# Altium project 2024_TCU.PrjPcb (part 1 of 2)
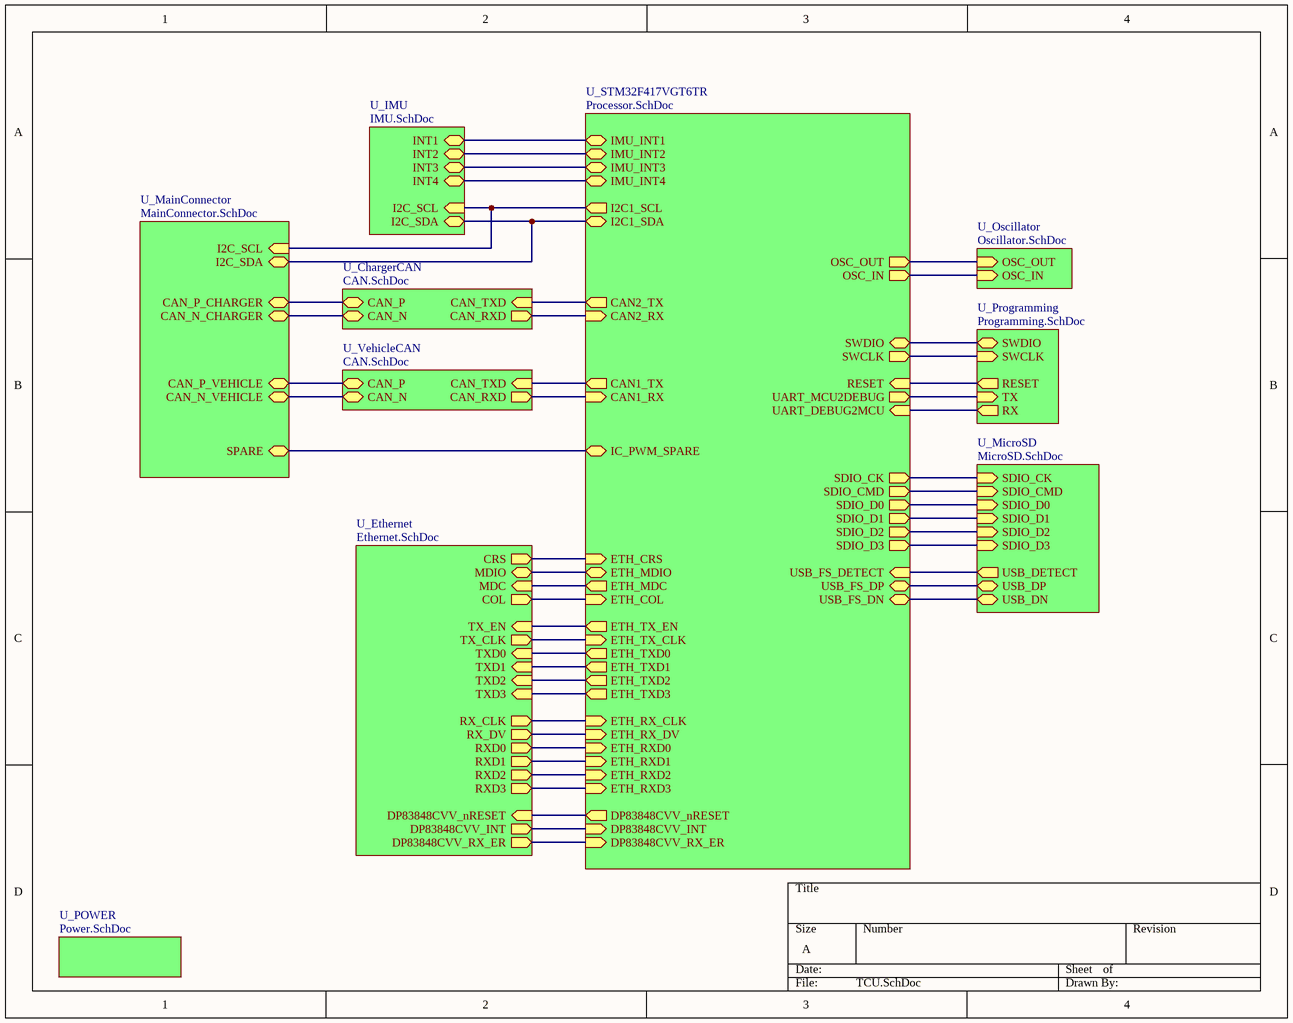
[diagram p0: TCU.SchDoc]
10 sheets, 116 parts. Net scope: hierarchical (ports join the sheet entries above them; power ports are global).
Board file: 2024_TCU.PcbDoc
Sheets:
  TCU.SchDoc
    U_MicroSD = MicroSD.SchDoc
    U_Programming = Programming.SchDoc
    U_VehicleCAN = CAN.SchDoc
    U_Oscillator = Oscillator.SchDoc
    U_STM32F417VGT6TR = Processor.SchDoc
    U_MainConnector = MainConnector.SchDoc
    U_ChargerCAN = CAN.SchDoc
    U_IMU = IMU.SchDoc
    U_Ethernet = Ethernet.SchDoc
    U_POWER = Power.SchDoc

## Sheet TCU.SchDoc
size A; SheetNumber: 1; SheetTotal: 10

### Sub-sheets
U_ChargerCAN = CAN.SchDoc: CAN_P (bidir), CAN_N (bidir), CAN_TXD (in), CAN_RXD (out)
U_Ethernet = Ethernet.SchDoc: DP83848CVV_INT (out), DP83848CVV_nRESET (in), CRS (out), RX_CLK (out), MDIO (bidir), COL (out), RX_DV (out), RXD2 (out), RXD3 (out), TX_EN (in), TXD0 (in), TXD1 (in), MDC (in), TXD2 (in), TX_CLK (out), RXD0 (out), RXD1 (out), TXD3 (in), DP83848CVV_RX_ER (out)
U_IMU = IMU.SchDoc: INT1 (bidir), INT2 (bidir), INT3 (bidir), INT4 (bidir), I2C_SDA (bidir), I2C_SCL (in)
U_MainConnector = MainConnector.SchDoc: CAN_P_VEHICLE (bidir), CAN_N_VEHICLE (bidir), CAN_P_CHARGER (bidir), CAN_N_CHARGER (bidir), I2C_SCL (in), I2C_SDA (bidir), SPARE (bidir)
U_MicroSD = MicroSD.SchDoc: SDIO_CK (in), SDIO_CMD (in), SDIO_D0 (in), SDIO_D1 (in), SDIO_D2 (in), SDIO_D3 (in), USB_DETECT (out), USB_DN (bidir), USB_DP (bidir)
U_Oscillator = Oscillator.SchDoc: OSC_IN (in), OSC_OUT (in)
U_POWER = Power.SchDoc: no entries
U_Programming = Programming.SchDoc: SWDIO (bidir), SWCLK (in), RESET (out), TX (in), RX (out)
U_STM32F417VGT6TR = Processor.SchDoc: OSC_OUT (out), OSC_IN (out), CAN1_TX (out), CAN1_RX (in), SWDIO (bidir), SWCLK (out), RESET (in), UART_MCU2DEBUG (out), UART_DEBUG2MCU (in), SDIO_CK (out), SDIO_CMD (out), SDIO_D0 (out), SDIO_D1 (out), SDIO_D2 (out), SDIO_D3 (out), USB_FS_DETECT (in), USB_FS_DP (bidir), USB_FS_DN (bidir), I2C1_SCL (out), I2C1_SDA (bidir), IMU_INT1 (bidir), IMU_INT2 (bidir), IMU_INT3 (bidir), IMU_INT4 (bidir), CAN2_RX (in), CAN2_TX (out), ETH_MDC (out), ETH_MDIO (bidir), DP83848CVV_INT (in), DP83848CVV_nRESET (out), ETH_COL (in), ETH_CRS (in), ETH_RXD0 (in), ETH_RXD1 (in), ETH_RXD2 (in), ETH_RXD3 (in), ETH_RX_CLK (in), ETH_RX_DV (in), ETH_TXD0 (out), ETH_TXD1 (out), ETH_TXD2 (out), ETH_TXD3 (out), ETH_TX_CLK (in), ETH_TX_EN (out), DP83848CVV_RX_ER (in), IC_PWM_SPARE (bidir)
U_VehicleCAN = CAN.SchDoc: CAN_P (bidir), CAN_N (bidir), CAN_TXD (in), CAN_RXD (out)

### Nets
CAN_CONN_H: sheet U_VehicleCAN/CAN_P, sheet U_MainConnector/CAN_P_VEHICLE
CAN_CONN_H: sheet U_MainConnector/CAN_P_CHARGER, sheet U_ChargerCAN/CAN_P  [a separate net that carries the same name]
CAN_CONN_L: sheet U_VehicleCAN/CAN_N, sheet U_MainConnector/CAN_N_VEHICLE
CAN_CONN_L: sheet U_MainConnector/CAN_N_CHARGER, sheet U_ChargerCAN/CAN_N  [a separate net that carries the same name]
MII_MDC: sheet U_STM32F417VGT6TR/ETH_MDC, sheet U_Ethernet/MDC
MII_MDIO: sheet U_STM32F417VGT6TR/ETH_MDIO, sheet U_Ethernet/MDIO
RESET: sheet U_Programming/RESET, sheet U_STM32F417VGT6TR/RESET
SD_CK: sheet U_MicroSD/SDIO_CK, sheet U_STM32F417VGT6TR/SDIO_CK
SD_CMD: sheet U_MicroSD/SDIO_CMD, sheet U_STM32F417VGT6TR/SDIO_CMD
SD_D0: sheet U_MicroSD/SDIO_D0, sheet U_STM32F417VGT6TR/SDIO_D0
SD_D1: sheet U_MicroSD/SDIO_D1, sheet U_STM32F417VGT6TR/SDIO_D1
SD_D2: sheet U_MicroSD/SDIO_D2, sheet U_STM32F417VGT6TR/SDIO_D2
SD_D3: sheet U_MicroSD/SDIO_D3, sheet U_STM32F417VGT6TR/SDIO_D3
SWCLK: sheet U_Programming/SWCLK, sheet U_STM32F417VGT6TR/SWCLK
SWDIO: sheet U_Programming/SWDIO, sheet U_STM32F417VGT6TR/SWDIO
UART_DGB2MCU: sheet U_Programming/RX, sheet U_STM32F417VGT6TR/UART_DEBUG2MCU
UART_MCU2DGB: sheet U_Programming/TX, sheet U_STM32F417VGT6TR/UART_MCU2DEBUG
USB_BOARD_N: sheet U_MicroSD/USB_DN, sheet U_STM32F417VGT6TR/USB_FS_DN
USB_BOARD_P: sheet U_MicroSD/USB_DP, sheet U_STM32F417VGT6TR/USB_FS_DP
NetC20_2: sheet U_Oscillator/OSC_IN, sheet U_STM32F417VGT6TR/OSC_IN
NetIC1_1: sheet U_STM32F417VGT6TR/IMU_INT2, sheet U_IMU/INT2
NetIC1_12: sheet U_STM32F417VGT6TR/IMU_INT3, sheet U_IMU/INT3
NetIC1_13: sheet U_STM32F417VGT6TR/IMU_INT4, sheet U_IMU/INT4
NetIC1_16: sheet U_STM32F417VGT6TR/IMU_INT1, sheet U_IMU/INT1
NetIC2_7: sheet U_STM32F417VGT6TR/DP83848CVV_INT, sheet U_Ethernet/DP83848CVV_INT
NetIC2_29: sheet U_STM32F417VGT6TR/DP83848CVV_nRESET, sheet U_Ethernet/DP83848CVV_nRESET
NetIC2_41: sheet U_STM32F417VGT6TR/DP83848CVV_RX_ER, sheet U_Ethernet/DP83848CVV_RX_ER
NetJ3_3: sheet U_STM32F417VGT6TR/I2C1_SCL, sheet U_MainConnector/I2C_SCL, sheet U_IMU/I2C_SCL
NetJ3_5: sheet U_STM32F417VGT6TR/IC_PWM_SPARE, sheet U_MainConnector/SPARE
NetJ3_8: sheet U_STM32F417VGT6TR/I2C1_SDA, sheet U_MainConnector/I2C_SDA, sheet U_IMU/I2C_SDA
NetR5_1: sheet U_Oscillator/OSC_OUT, sheet U_STM32F417VGT6TR/OSC_OUT
NetR14_1: sheet U_STM32F417VGT6TR/ETH_TXD0, sheet U_Ethernet/TXD0
NetR15_1: sheet U_STM32F417VGT6TR/ETH_RXD0, sheet U_Ethernet/RXD0
NetR16_1: sheet U_STM32F417VGT6TR/ETH_TXD1, sheet U_Ethernet/TXD1
NetR17_1: sheet U_STM32F417VGT6TR/ETH_RXD1, sheet U_Ethernet/RXD1
NetR18_1: sheet U_STM32F417VGT6TR/ETH_TXD2, sheet U_Ethernet/TXD2
NetR19_1: sheet U_STM32F417VGT6TR/ETH_RXD2, sheet U_Ethernet/RXD2
NetR20_1: sheet U_STM32F417VGT6TR/ETH_TXD3, sheet U_Ethernet/TXD3
NetR21_1: sheet U_STM32F417VGT6TR/ETH_RXD3, sheet U_Ethernet/RXD3
NetR22_1: sheet U_STM32F417VGT6TR/ETH_TX_CLK, sheet U_Ethernet/TX_CLK
NetR23_1: sheet U_STM32F417VGT6TR/ETH_TX_EN, sheet U_Ethernet/TX_EN
NetR26_1: sheet U_STM32F417VGT6TR/ETH_CRS, sheet U_Ethernet/CRS
NetR27_1: sheet U_STM32F417VGT6TR/ETH_RX_DV, sheet U_Ethernet/RX_DV
NetR28_1: sheet U_STM32F417VGT6TR/ETH_RX_CLK, sheet U_Ethernet/RX_CLK
NetR29_1: sheet U_STM32F417VGT6TR/ETH_COL, sheet U_Ethernet/COL
NetR48_2: sheet U_MicroSD/USB_DETECT, sheet U_STM32F417VGT6TR/USB_FS_DETECT
NetU2_81: sheet U_VehicleCAN/CAN_RXD, sheet U_STM32F417VGT6TR/CAN1_RX
NetU2_82: sheet U_VehicleCAN/CAN_TXD, sheet U_STM32F417VGT6TR/CAN1_TX
NetU2_91: sheet U_STM32F417VGT6TR/CAN2_RX, sheet U_ChargerCAN/CAN_RXD
NetU2_92: sheet U_STM32F417VGT6TR/CAN2_TX, sheet U_ChargerCAN/CAN_TXD

## Sheet MicroSD.SchDoc
size A; SheetNumber: 9; SheetTotal: 10
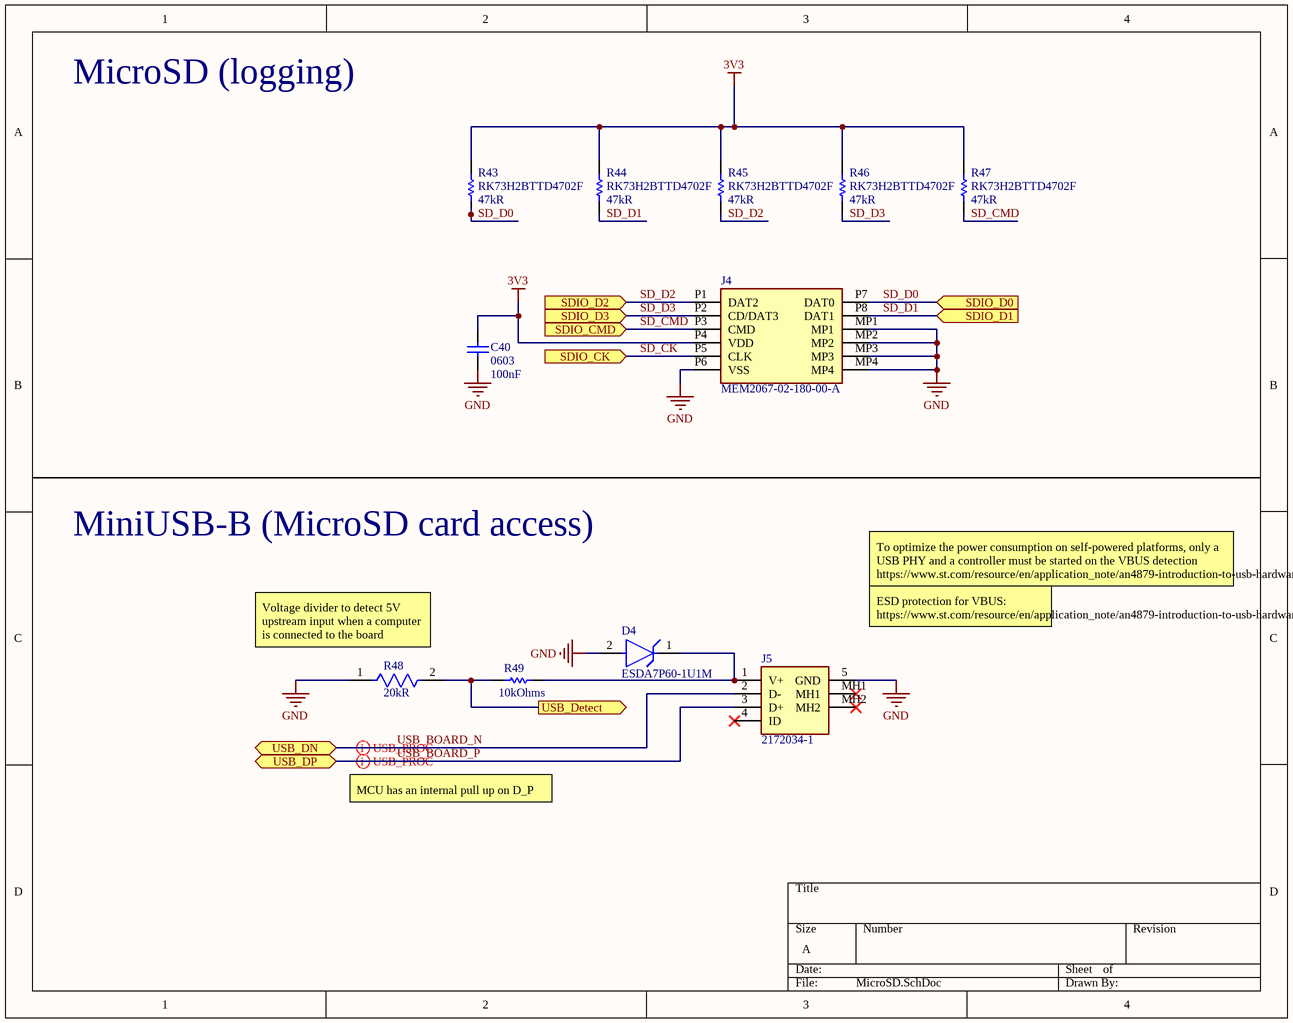
[diagram p1: MicroSD.SchDoc]

### Parts
C40  Case Code (Imperial): 0603  Capacitance: 100nF  [CAPC1608X87X35NL15T15]  (hidden comment: C0603X104K5RACTU)
D4  ESDA7P60-1U1M  [FP-1610-MFG]
J4  MEM2067-02-180-00-A  [MEM20670218000A]
J5  2172034-1  [21720341]
R43  RK73H2BTTD4702F  value 47kR  [RESC3216X70X40NL20T20]
R44  RK73H2BTTD4702F  value 47kR  [RESC3216X70X40NL20T20]
R45  RK73H2BTTD4702F  value 47kR  [RESC3216X70X40NL20T20]
R46  RK73H2BTTD4702F  value 47kR  [RESC3216X70X40NL20T20]
R47  RK73H2BTTD4702F  value 47kR  [RESC3216X70X40NL20T20]
R48  Resistance: 20kR  [FP-CRCW0805-e3-IPC_B]  (hidden comment: CRCW080520K0JNEB)
R49  Resistance: 10kOhms  [RESC1608X55X25ML10T15]  (hidden comment: RC0603JR-0710KL)

### Ports
SDIO_CK (in, see TCU[4B], Processor[2D]), SDIO_CMD (in, see TCU[4B], Processor[3B]), SDIO_D0 (in, see TCU[4B], Processor[2C]), SDIO_D1 (in, see TCU[4C], Processor[2C]), SDIO_D2 (in, see TCU[4C], Processor[2C]), SDIO_D3 (in, see TCU[4C], Processor[2D]), USB_Detect (out, see TCU[4C]), USB_DN (bidir, see TCU[4C]), USB_DP (bidir, see TCU[4C])

### Nets
3V3: C40.1 J4.P4(VDD) R43.2 R44.2 R45.2 R46.2 R47.2  [project net AVDD33]
GND: C40.2 D4.2(A) J4.MP1 J4.MP2 J4.MP3 J4.MP4 J4.P6(VSS) J5.5(GND) R48.1
SD_CK: J4.P5(CLK) ; port SDIO_CK
SD_CMD: J4.P3(CMD) R47.1 ; port SDIO_CMD
SD_D0: J4.P7(DAT0) R43.1 ; port SDIO_D0
SD_D1: J4.P8(DAT1) R44.1 ; port SDIO_D1
SD_D2: J4.P1(DAT2) R45.1 ; port SDIO_D2
SD_D3: J4.P2(CD/DAT3) R46.1 ; port SDIO_D3
USB_BOARD_N: J5.2(D-) ; port USB_DN
USB_BOARD_P: J5.3(D+) ; port USB_DP
NetD4_1: D4.1(C) J5.1(V+) R49.2
NetR48_2: R48.2 R49.1 ; port USB_Detect

Not connected (* = marked no-connect by the designer): J5 4(ID)* MH1* MH2*

### Layout directives
differential pair: USB_BOARD_N, USB_BOARD_P

### Notes on the sheet
- MicroSD (logging)
- MiniUSB-B (MicroSD card access)
- (near R48) Voltage divider to detect 5V upstream input when a computer is connected to the board
- ESD protection for VBUS:
  https://www.st.com/resource/en/application_note/an4879-introduction-to-usb-hardware-and-pcb-guidelines-using-stm32-mcus-stmicroelectronics.pdf
- To optimize the power consumption on self-powered platforms, only a USB PHY and a controller must be started on the VBUS detection
  https://www.st.com/resource/en/application_note/an4879-introduction-to-usb-hardware-and-pcb-guidelines-using-stm32-mcus-stmicroelectronics.pdf
- MCU has an internal pull up on D_P

### Library data of the parts
C40 = CMP-2006-03300-1: Manufacturer: Kemet; Dielectric Material: Ceramic; Tolerance: 10%; Voltage Rating: 50V; Dielectric: X7R; Dissipation Factor: 2.5%; Part Number: C0603X104K5RACTU; Supplier 1: Digi-Key; Supplier Part Number 1: 399-7969-1-ND; Manufacturer Part Number: C0603X104K5RACTU; Stock 1: 2206541; Pricing 1: 1 = 0.21000, 10 = 0.14500, 100 = 0.07340, 500 = 0.05024, 1000 = 0.04444 (USD); RoHS: Yes; Mount: Surface Mount; Case/Package: 0603; Number of Pins: 2; Case Code (Metric): 1608; Min Operating Temperature: -55°C; Max Operating Temperature: 125°C; Packaging: Tape and Reel; Package Quantity: 1; Voltage Rating (DC): 50V; Termination: SMD/SMT; Voltage: 50V; Features: Soft Termination; Length: 1.6mm; Height: 0.8mm; Width: 0.8mm; Depth: 0.8mm; Thickness: 0.034inch; Radiation Hardening: No; REACH SVHC: No SVHC; ComponentLink1URL: https://datasheet.ciiva.com/7823/1776088-7823908.pdf?src-supplier=Element14; ComponentLink1Description: https://datasheet.ciiva.com/7823/1776088-7823908.pdf?src-supplier=Element14; ComponentLink2URL: https://datasheet.ciiva.com/26948/getdatasheetpartid-385607-26948458.pdf?src-supplier=Verical; ComponentLink2Description: https://datasheet.ciiva.com/26948/getdatasheetpartid-385607-26948458.pdf?src-supplier=Verical; ComponentLink3URL: https://datasheet.ciiva.com/7823/1776088-7823909.pdf?src-supplier=Element14; ComponentLink3Description: https://datasheet.ciiva.com/7823/1776088-7823909.pdf?src-supplier=Element14; ComponentLink4URL: https://datasheet.ciiva.com/6279/kem-c1013-x7r-ft-cap-smd-6279993.pdf?src-supplier=Digi-Key; ComponentLink4Description: https://datasheet.ciiva.com/6279/kem-c1013-x7r-ft-cap-smd-6279993.pdf?src-supplier=Digi-Key; ComponentLink5URL: https://datasheet.ciiva.com/28533/1918693-28533212.pdf?src-supplier=Element14; ComponentLink5Description: https://datasheet.ciiva.com/28533/1918693-28533212.pdf?src-supplier=Element14; ComponentLink6URL: https://datasheet.ciiva.com/6279/kem-c1013-x7r-ft-cap-smd-6279999.pdf?src-supplier=Digi-Key; ComponentLink6Description: https://datasheet.ciiva.com/6279/kem-c1013-x7r-ft-cap-smd-6279999.pdf?src-supplier=Digi-Key; ComponentLink7URL: https://datasheet.ciiva.com/6279/kem-c1013-x7r-ft-cap-smd-6279990.pdf?src-supplier=Digi-Key; ComponentLink7Description: https://datasheet.ciiva.com/6279/kem-c1013-x7r-ft-cap-smd-6279990.pdf?src-supplier=Digi-Key; ComponentLink8URL: https://datasheet.ciiva.com/14597/70096394-14597743.pdf?src-supplier=Allied+Electronics; ComponentLink8Description: https://datasheet.ciiva.com/14597/70096394-14597743.pdf?src-supplier=Allied+Electronics
D4 = CMP-12225-000013-1: TVS DIODE 5V 11.6V 1610; Manufacturer: STMicroelectronics; Number Of Channels: 1; Standoff Height: 0mm; Breakdown Voltage: 6.4V; Direction: Unidirectional; Clamping Voltage: 10.2V; Peak Pulse Power: 700W; Peak Pulse Current: 60A; Max Junction Temp: +150°C; ComponentLink2Description: Datasheet; Temperature Range Low: -55°C; Package: 1610; Lead Free: Yes; Temperature Range High: +150°C; Temperature: -55°C to +150°C; Device Class L2: TVS Diodes; Category: Diode; Device Class L1: Circuit Protection; Manufacturer Part Number: ESDA7P60-1U1M; Digikey Description: TVS DIODE 5V 11.6V 1610; ComponentLink2URL: http://www.st.com/content/ccc/resource/technical/document/datasheet/44/e9/26/44/42/ee/4f/e5/DM00139972.pdf/files/DM00139972.pdf/jcr:content/translations/en.DM00139972.pdf; Reverse Standoff Voltage: 5V; RoHS: TRUE; Octopart: https://octopart.com/esda7p60-1u1m-stmicroelectronics-52112702; Height: 0.65mm; Device Class L3: unset; Automotive: No
J4 = MEM2067-02-180-00-A: Connector; Manufacturer_Name: GCT (GLOBAL CONNECTOR TECHNOLOGY); Datasheet Link: https://gct.co/files/drawings/mem2067.pdf; Height: 1.95mm; Manufacturer_Part_Number: MEM2067-02-180-00-A; Mouser Part Number: 640-MEM20670218000A; Mouser Price/Stock: https://www.mouser.co.uk/ProductDetail/GCT/MEM2067-02-180-00-A?qs=KUoIvG%2F9IlYTw%2Fcc1GlNJA%3D%3D; Supplier 1: Future Electronics; Supplier Part Number 1: 7054324
J5 = 2172034-1: Connector; Manufacturer_Name: TE Connectivity; Datasheet Link: https://www.te.com/commerce/DocumentDelivery/DDEController?Action=srchrtrv&DocNm=2172034&DocType=Customer+Drawing&DocLang=English; Height: 3.9mm; Manufacturer_Part_Number: 2172034-1; Mouser Part Number: 571-2172034-1; Mouser Price/Stock: https://www.mouser.co.uk/ProductDetail/TE-Connectivity/2172034-1?qs=Ev%252BS503VEAHBC%252BPBdsvCGg%3D%3D; Arrow Part Number: 2172034-1; Arrow Price/Stock: https://www.arrow.com/en/products/2172034-1/te-connectivity?region=nac; Supplier 1: Avnet; Supplier Part Number 1: 68AH8515
R43-R47 = CMP-2003-01472-1: Manufacturer: KOA Speer; Part Number: RK73H2BTTD4702F
R48 = CMP-02407-010660-1: RES Thick Film, 20kΩ, 5%, 0.125W, 200ppm/°C, 0805; Voltage Rating: 150V; Max Power Dissipation: 125mW; Case/Package: 0805; Number of Terminations: 2; Features: Automotive AEC-Q200; Tolerance: 5%; Height: 0.02inch; Case Code (Metric): 2012; Temperature Coefficient: 200ppm/°C; Max Operating Temperature: 155°C; Min Operating Temperature: -55°C; Length: 0.079inch; Weight: 0.000194oz; Case Code (Imperial): 0805; Composition: Thick Film; Width: 1.25mm; Lead Free: Lead Free; Power Rating: 125mW; Packaging: Tape and Reel; Termination: SMD/SMT; Package Quantity: 10000
R49 = CMP-2000-05022-1: Resistor, 10 KOhm, +/- 5%, 100 mW, -55 to 155 degC, 0603 (1608 Metric), RoHS, Tape and Reel; Manufacturer: Yageo; Voltage Rating: 50V; Temperature Coefficient: 100PPM/C; Power Rating: 100mW; Package Reference: 603; Series: RC; Case Code - mm: 1608; Packaging: Reel; Datasheet URL: http://www.farnell.com/datasheets/443971.pdf; Datasheet Version: Rev. 4, 04/2009; Operating Temperature Range: -55Cto+155C; Product: ThickFilmResistorsGeneralPurpose; Package Description: 2-Pin Surface Mount Device, Body 1.6 x 0.8 mm; Manufacturer URL: http://www.yageo.com/; Case Code - in: 0603; Tolerance: 5%; Termination Style: SMD/SMT

## Sheet Programming.SchDoc
size A4; DocumentNumber: 3; SheetNumber: 3; SheetTotal: 10
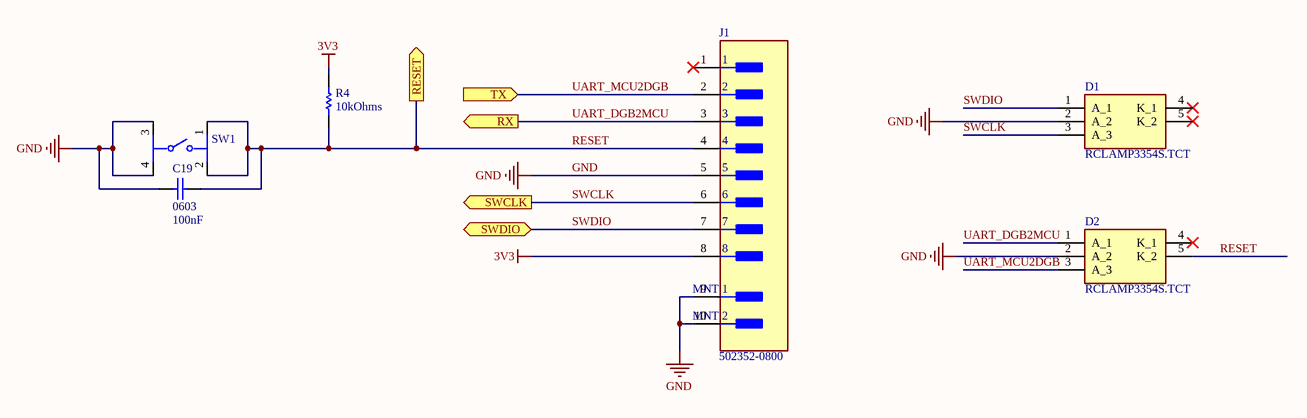
[diagram p2: Programming.SchDoc]

### Parts
C19  Case Code (Imperial): 0603  Capacitance: 100nF  [CAPC1608X87X35NL15T15]  (hidden comment: C0603X104K5RACTU)
D1  RCLAMP3354S.TCT  [SOT95P280X145-5N]
D2  RCLAMP3354S.TCT  [SOT95P280X145-5N]
J1  502352-0800  [FP-502352-0800-MFG]
R4  Resistance: 10kOhms  [RESC1608X55X25ML10T15]  (hidden comment: RC0603JR-0710KL)
SW1  PTS645SM43SMTR92LFS  [FP-PTS645SM43SMTR92LFS-MFG]  (value not drawn)

### Ports
RESET (out, see TCU[4B], Processor[3B]), RX (out, see TCU[4B]), SWCLK (out, see TCU[4B], Processor[2B]), SWDIO (bidir, see TCU[4B], Processor[2B]), TX (in, see TCU[4B])

### Nets
3V3: J1.8 R4.2  [project net AVDD33]
GND: C19.2 D1.2(A_2) D2.2(A_2) J1.5 J1.9(MNT_1) J1.10(MNT_2) SW1.3 SW1.4
RESET: C19.1 D2.5(K_2) J1.4 R4.1 SW1.1 SW1.2 ; port RESET
SWCLK: D1.3(A_3) J1.6 ; port SWCLK
SWDIO: D1.1(A_1) J1.7 ; port SWDIO
UART_DGB2MCU: D2.1(A_1) J1.3 ; port RX
UART_MCU2DGB: D2.3(A_3) J1.2 ; port TX

Not connected (* = marked no-connect by the designer): D1 4(K_1)* 5(K_2)*; D2 4(K_1)*; J1 1*

### Library data of the parts
C19 = CMP-2006-03300-1: as C40 on sheet MicroSD; Part Number: C0603X104K5RACTU; Supplier 1: Digi-Key; Supplier Part Number 1: 399-7969-1-ND; Manufacturer Part Number: C0603X104K5RACTU; Stock 1: 2206541; Pricing 1: 1 = 0.21000, 10 = 0.14500, 100 = 0.07340, 500 = 0.05024, 1000 = 0.04444 (USD); RoHS: Yes; Mount: Surface Mount; Case/Package: 0603; Number of Pins: 2; Case Code (Metric): 1608; Min Operating Temperature: -55°C; Max Operating Temperature: 125°C; Packaging: Tape and Reel; Package Quantity: 1; Voltage Rating (DC): 50V; Termination: SMD/SMT; Voltage: 50V; Features: Soft Termination; Length: 1.6mm; Height: 0.8mm; Width: 0.8mm; Depth: 0.8mm; Thickness: 0.034inch; Radiation Hardening: No; REACH SVHC: No SVHC; ComponentLink1URL: https://datasheet.ciiva.com/7823/1776088-7823908.pdf?src-supplier=Element14; ComponentLink1Description: https://datasheet.ciiva.com/7823/1776088-7823908.pdf?src-supplier=Element14; ComponentLink2URL: https://datasheet.ciiva.com/26948/getdatasheetpartid-385607-26948458.pdf?src-supplier=Verical; ComponentLink2Description: https://datasheet.ciiva.com/26948/getdatasheetpartid-385607-26948458.pdf?src-supplier=Verical; ComponentLink3URL: https://datasheet.ciiva.com/7823/1776088-7823909.pdf?src-supplier=Element14; ComponentLink3Description: https://datasheet.ciiva.com/7823/1776088-7823909.pdf?src-supplier=Element14; ComponentLink4URL: https://datasheet.ciiva.com/6279/kem-c1013-x7r-ft-cap-smd-6279993.pdf?src-supplier=Digi-Key; ComponentLink4Description: https://datasheet.ciiva.com/6279/kem-c1013-x7r-ft-cap-smd-6279993.pdf?src-supplier=Digi-Key; ComponentLink5URL: https://datasheet.ciiva.com/28533/1918693-28533212.pdf?src-supplier=Element14; ComponentLink5Description: https://datasheet.ciiva.com/28533/1918693-28533212.pdf?src-supplier=Element14; ComponentLink6URL: https://datasheet.ciiva.com/6279/kem-c1013-x7r-ft-cap-smd-6279999.pdf?src-supplier=Digi-Key; ComponentLink6Description: https://datasheet.ciiva.com/6279/kem-c1013-x7r-ft-cap-smd-6279999.pdf?src-supplier=Digi-Key; ComponentLink7URL: https://datasheet.ciiva.com/6279/kem-c1013-x7r-ft-cap-smd-6279990.pdf?src-supplier=Digi-Key; ComponentLink7Description: https://datasheet.ciiva.com/6279/kem-c1013-x7r-ft-cap-smd-6279990.pdf?src-supplier=Digi-Key; ComponentLink8URL: https://datasheet.ciiva.com/14597/70096394-14597743.pdf?src-supplier=Allied+Electronics; ComponentLink8Description: https://datasheet.ciiva.com/14597/70096394-14597743.pdf?src-supplier=Allied+Electronics
D1 D2 = RCLAMP3354S.TCT: TVS Diode (Bi-directional); Manufacturer_Name: SEMTECH; Datasheet Link: https://semtech.my.salesforce.com/sfc/p/#E0000000JelG/a/44000000MCrm/q3IJaquvh9BkANCL4E8HYT8vxS.k3jwPHRhsWr6XNsI; Height: 1.45mm; Manufacturer_Part_Number: RCLAMP3354S.TCT; Mouser Part Number: 947-RCLAMP3354S.TCT; Mouser Price/Stock: https://www.mouser.co.uk/ProductDetail/Semtech/RCLAMP3354S.TCT?qs=rBWM4%252BvDhIcjyMg1J9MbMw%3D%3D; Arrow Part Number: RCLAMP3354S.TCT; Arrow Price/Stock: https://www.arrow.com/en/products/rclamp3354s.tct/semtech?region=europe
  D1: Supplier 1: Arrow Electronics; Supplier Part Number 1: RCLAMP3354S.TCT
J1 = CMP-04776-000280-1: CONN HEADER SMD R/A 8POS 2MM; Max Current Rating: 3A; Primary Type: Rectangular; Number of Contacts: 8; Gender: Male; Connector Type: Male Pin; Glow Wire Compliant: Non-compliant; Voltage Rating: 125V; Orientation: Right Angle; Contact Plating: Tin; Series: DuraClik™ 502352; Color: Natural; Mount: Surface Mount; Contact Gender: Male; Length: 20mm; Radiation Hardening: No; Max Operating Temperature: 105°C; Package Quantity: 2800; Housing Material: Polyamide; Depth: 9.4mm; Current Rating: 3A; Pitch: 2mm; Housing Color: Natural; Contact Type: Male Pin; Number of Circuits: 8; Contact Material: Copper Alloy; Fastening Type: Latch; Number of Positions: 8; Packaging: Tape and Reel; Termination: Solder; Number of Rows: 1; Min Operating Temperature: -40°C
R4 = CMP-2000-05022-1: as R49 on sheet MicroSD; Package Reference: 603; Series: RC; Case Code - mm: 1608; Packaging: Reel; Datasheet URL: http://www.farnell.com/datasheets/443971.pdf; Datasheet Version: Rev. 4, 04/2009; Operating Temperature Range: -55Cto+155C; Product: ThickFilmResistorsGeneralPurpose; Package Description: 2-Pin Surface Mount Device, Body 1.6 x 0.8 mm; Manufacturer URL: http://www.yageo.com/; Case Code - in: 0603; Tolerance: 5%; Termination Style: SMD/SMT
SW1 = CMP-2000-05160-2: SWITCH TACTILE SPST-NO 0.05A 12V; Contact Resistance: 100mR; Throw Configuration: SPST; Illumination Type: Non-Illuminated; Mechanical Life: 100000Cycles; Current Rating: 50mA; Switch Function: Off-Mom; Actuator Length: 0.85mm; Actuator Material: Nylon; Actuator Type: Standard; Operating Force: 160gf; Min Operating Temperature: -20°C; REACH SVHC: No SVHC; Termination: Gull Wing; Case/Package: SMD/SMT; Packaging: Tape and Reel; Mount: Surface Mount; Voltage Rating (DC): 12V; Orientation: Straight; Lead Free: Lead Free; Contact Material: Silver; Color: Black; Max Current Rating: 50mA; Contact Plating: Silver; Depth: 9mm; Package Quantity: 1; Max Voltage Rating (DC): 12V; Length: 6mm; Max Operating Temperature: 60°C

## Sheet CAN.SchDoc
size A; SheetNumber: 6; SheetTotal: 10
Used 2 times, as channels U_VehicleCAN, U_ChargerCAN. Parts and nets are listed once, with the designators drawn on the sheet.
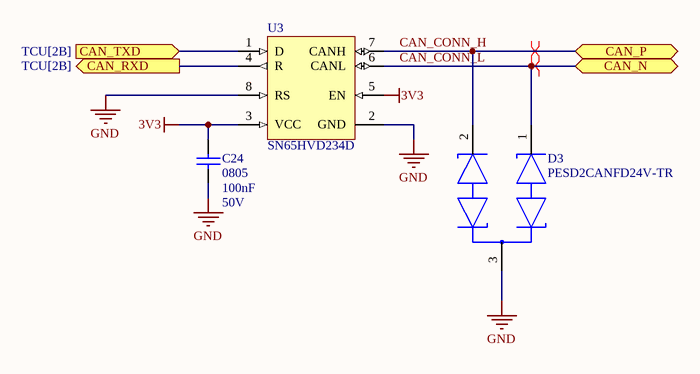
[diagram p3: CAN.SchDoc]

### Parts
C24  Case Code (Imperial): 0805  Capacitance: 100nF  Voltage Rating: 50V  [CAPC2013X88X50NL20T25]  (hidden comment: C0805C104K5RACTU)
D3  PESD2CANFD24V-TR  [FP-SOT23-IPC_A]
U3  SN65HVD234D  [D0008A_M]

### Ports
CAN_N (bidir, see TCU[2B]), CAN_P (bidir, see TCU[2B]), CAN_RXD (out, see TCU[2B]), CAN_TXD (in, see TCU[2B])

### Nets
3V3: C24.1 U3.3(VCC) U3.5(EN)
GND: C24.2 D3.3(CC) U3.2(GND) U3.8(RS)
CAN_CONN_H: D3.2(K2) U3.7(CANH) ; port CAN_P
CAN_CONN_L: D3.1(K1) U3.6(CANL) ; port CAN_N
CAN_RXD: U3.4(R) ; port CAN_RXD
CAN_TXD: U3.1(D) ; port CAN_TXD

### Channels
U_VehicleCAN: designators end in A; ports CAN_N=CAN_CONN_L CAN_P=CAN_CONN_H CAN_RXD=NetU2_81 CAN_TXD=NetU2_82
U_ChargerCAN: designators end in B; ports CAN_N=CAN_CONN_L CAN_P=CAN_CONN_H CAN_RXD=NetU2_91 CAN_TXD=NetU2_92

### Layout directives
differential pair: CAN_CONN_H, CAN_CONN_L

### Library data of the parts
C24 = CMP-2007-00279-1: Manufacturer: Kemet; Dielectric Material: Ceramic; Tolerance: 10%; Dielectric: X7R; Voltage: 500V; Part Number: C0805C104K5RACTU; Supplier 1: Digi-Key; Supplier Part Number 1: 399-1170-1-ND; Manufacturer Part Number: C0805C104K5RACTU; Stock 1: 1913908; Pricing 1: 1 = 0.23000, 10 = 0.16600, 100 = 0.07800, 500 = 0.05472, 1000 = 0.04530 (USD); RoHS: Yes; Mount: Surface Mount; Case/Package: 0805; Number of Pins: 2; Case Code (Metric): 2012; Contact Plating: Tin; Min Operating Temperature: -55°C; Max Operating Temperature: 125°C; Packaging: Tape and Reel; Voltage Rating (DC): 50V; Package Quantity: 1; Termination: SMD/SMT; Length: 2mm; Height: 0.9mm; Depth: 1.25mm; Width: 1.2mm; Thickness: 0.035inch; Lead Pitch: 0.75mm; Radiation Hardening: No; REACH SVHC: No SVHC; ComponentLink1URL: https://datasheet.ciiva.com/14589/70095383-14589048.pdf?src-supplier=Allied+Electronics; ComponentLink1Description: https://datasheet.ciiva.com/14589/70095383-14589048.pdf?src-supplier=Allied+Electronics; ComponentLink2URL: https://datasheet.ciiva.com/28682/1851736-28682232.pdf?src-supplier=Element14; ComponentLink2Description: https://datasheet.ciiva.com/28682/1851736-28682232.pdf?src-supplier=Element14; ComponentLink3URL: https://datasheet.ciiva.com/32431/slceramic-chip-condensers-e-32431755.pdf?src-supplier=Distrelec; ComponentLink3Description: https://datasheet.ciiva.com/32431/slceramic-chip-condensers-e-32431755.pdf?src-supplier=Distrelec; ComponentLink4URL: https://datasheet.ciiva.com/18410/70095383-18410815.pdf?src-supplier=Allied+Electronics; ComponentLink4Description: https://datasheet.ciiva.com/18410/70095383-18410815.pdf?src-supplier=Allied+Electronics
D3 = CMP-14436-000014-1: TVS DIODE 24VWM 42VC TO236AB
U3 = CMP-0315-00083-2: 3.3V CAN Transceiver with Sleep Mode, 6 mA, -40 to 125 degC, 8-pin SOIC (D), Green (RoHS & no Sb/Br); Manufacturer: Texas Instruments; Rating: Catalog; Receivers Per Package: 1; Bus Fault Voltage(V): +/-30; Transient Pulse Protection(V): -100 to 100; ICC(Max)(mA): 6; Supply Voltage(s)(V): 3.3; DatasheetVersion: SLLS557F; PackageVersion: revM, Jun-2011; Eco-Plan: Green (RoHS & no Sb/Br); PackageReference: D0008A; Drivers Per Package: 1; SubFamily: CAN; Code_JEDEC: MS-012AA; Isolated: No; ComponentLink1URL: http://www.ti.com/general/docs/lit/getliterature.tsp?genericPartNumber=SN65HVD234&fileType=pdf; Mounting Technology: Surface Mount; PackageDescription: 8-Pin Plastic Small Outline Integrated Circuit, 4.9 x 3.9 mm, Pitch 1.27 mm Pitch; PartNumber: SN65HVD234D; Footprint: PCA82C250, excludes pin5; Low Power Mode: Sleep; ComponentLink1Description: Datasheet

## Sheet Oscillator.SchDoc
size A; SheetNumber: 4; SheetTotal: 10
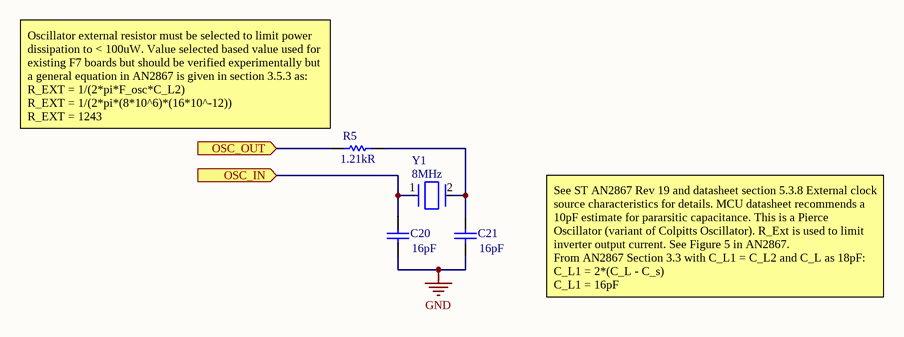
[diagram p4: Oscillator.SchDoc]

### Parts
C20  Capacitance: 16pF  [CAPC1608X90X35ML15T15]  (hidden comment: 06035A160JAT2A)
C21  Capacitance: 16pF  [CAPC1608X90X35ML15T15]  (hidden comment: 06035A160JAT2A)
R5  Resistance: 1.21kR  [RESC1005X40X25NL10T10]  (hidden comment: CR0402-FX-1211GLF)
Y1  Frequency: 8MHz  [FP-ABM3-MFG]  (hidden comment: ABM3-8.000MHZ-D2Y-T)

### Ports
OSC_IN (in, see TCU[4B], Processor[3B]), OSC_OUT (in, see TCU[4B], Processor[3B])

### Nets
GND: C20.1 C21.1
NetC20_2: C20.2 Y1.1 ; port OSC_IN
NetC21_2: C21.2 R5.2 Y1.2
NetR5_1: R5.1 ; port OSC_OUT

### Notes on the sheet
- (near R5) Oscillator external resistor must be selected to limit power dissipation to < 100uW. Value selected based value used for existing F7 boards but should be verified experimentally but a general equation in AN2867 is given in section 3.5.3 as:
  R_EXT = 1/(2*pi*F_osc*C_L2)
  R_EXT = 1/(2*pi*(8*10^6)*(16*10^-12))
  R_EXT = 1243
- See ST AN2867 Rev 19 and datasheet section 5.3.8 External clock source characteristics for details. MCU datasheet recommends a 10pF estimate for pararsitic capacitance. This is a Pierce Oscillator (variant of Colpitts Oscillator). R_Ext is used to limit inverter output current. See Figure 5 in AN2867.
  From AN2867 Section 3.3 with C_L1 = C_L2 and C_L as 18pF:
  C_L1 = 2*(C_L - C_s)
  C_L1 = 16pF

### Library data of the parts
C20 C21 = CMP-2006-04247-1: Manufacturer: AVX Interconnect / Elco; Part Number: 06035A160JAT2A
R5 = CMP-2002-04749-1: Manufacturer: Bourns; Part Number: CR0402-FX-1211GLF
Y1 = CMP-2000-05033-2: Crystal 8MHz ±20ppm 18pF SMD-2 5mm x 3.2mm; Series Resistance: 500R; Frequency Stability: 30ppm; ESR (Equivalent Series Resistance): 140R; Load Capacitance: 18pF; Height: 0.051inch; Tolerance: 20ppm; Depth: 3.2mm; Max Operating Temperature: 85°C; Termination: SMD/SMT; Lead Free: Lead Free; Number of Pins: 2; Width: 3.2mm; RoHS Compliant: Yes; Resistor Type: Ceramic; Length: 5mm; Mount: Surface Mount; Case/Package: CSMD; Package Quantity: 1000; Radiation Hardening: No; Min Operating Temperature: -40°C; Packaging: Tape and Reel; Frequency Tolerance: 20ppm

## Sheet Processor.SchDoc
size A4; SheetNumber: 2; SheetTotal: 10
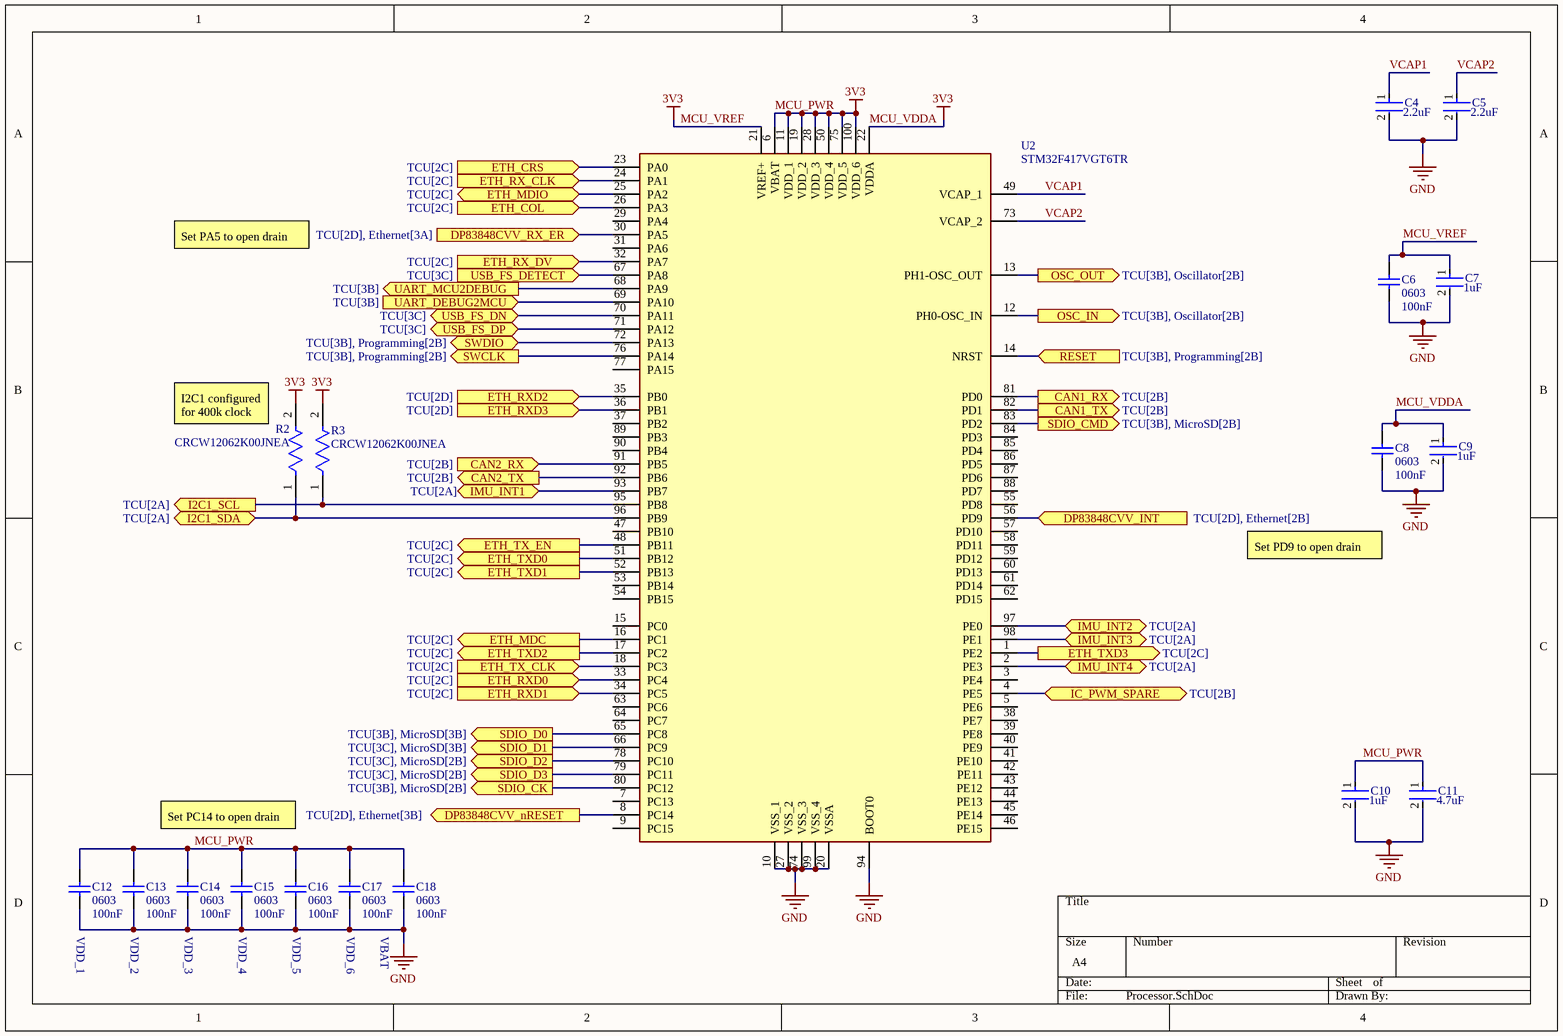
[diagram p5: Processor.SchDoc]

### Parts
C4  Capacitance: 2.2uF  [FP-C0603C225K4PACTU-MFG]  (hidden comment: C0603C225K4PACTU)
C5  Capacitance: 2.2uF  [FP-C0603C225K4PACTU-MFG]  (hidden comment: C0603C225K4PACTU)
C6  Case Code (Imperial): 0603  Capacitance: 100nF  [CAPC1608X87X35NL15T15]  (hidden comment: C0603X104K5RACTU)
C7  Capacitance: 1uF  [FP-CL10-IPC_C]  (hidden comment: CL10A105KA8NNNC)
C8  Case Code (Imperial): 0603  Capacitance: 100nF  [CAPC1608X87X35NL15T15]  (hidden comment: C0603X104K5RACTU)
C9  Capacitance: 1uF  [FP-CL10-IPC_C]  (hidden comment: CL10A105KA8NNNC)
C10  Capacitance: 1uF  [FP-CL10-IPC_C]  (hidden comment: CL10A105KA8NNNC)
C11  Capacitance: 4.7uF  [FP-C1005-050-0_15-MFG]  (hidden comment: C1005X5R1A475K050BC)
C12  Case Code (Imperial): 0603  Capacitance: 100nF  [CAPC1608X87X35NL15T15]  (hidden comment: C0603X104K5RACTU)
C13  Case Code (Imperial): 0603  Capacitance: 100nF  [CAPC1608X87X35NL15T15]  (hidden comment: C0603X104K5RACTU)
C14  Case Code (Imperial): 0603  Capacitance: 100nF  [CAPC1608X87X35NL15T15]  (hidden comment: C0603X104K5RACTU)
C15  Case Code (Imperial): 0603  Capacitance: 100nF  [CAPC1608X87X35NL15T15]  (hidden comment: C0603X104K5RACTU)
C16  Case Code (Imperial): 0603  Capacitance: 100nF  [CAPC1608X87X35NL15T15]  (hidden comment: C0603X104K5RACTU)
C17  Case Code (Imperial): 0603  Capacitance: 100nF  [CAPC1608X87X35NL15T15]  (hidden comment: C0603X104K5RACTU)
C18  Case Code (Imperial): 0603  Capacitance: 100nF  [CAPC1608X87X35NL15T15]  (hidden comment: C0603X104K5RACTU)
R2  CRCW12062K00JNEA  [FP-CRCW1206-e3-IPC_B]
R3  CRCW12062K00JNEA  [FP-CRCW1206-e3-IPC_B]
U2  STM32F417VGT6TR  [STM-LQFP100_N]

### Ports
CAN1_RX (out, see TCU[2B]), CAN1_TX (out, see TCU[2B]), CAN2_RX (in, see TCU[2B]), CAN2_TX (out, see TCU[2B]), DP83848CVV_INT (in, see TCU[2D], Ethernet[2B]), DP83848CVV_nRESET (out, see TCU[2D], Ethernet[3B]), DP83848CVV_RX_ER (in, see TCU[2D], Ethernet[3A]), ETH_COL (in, see TCU[2C]), ETH_CRS (in, see TCU[2C]), ETH_MDC (out, see TCU[2C]), ETH_MDIO (bidir, see TCU[2C]), ETH_RX_CLK (in, see TCU[2C]), ETH_RX_DV (in, see TCU[2C]), ETH_RXD0 (in, see TCU[2C]), ETH_RXD1 (in, see TCU[2C]), ETH_RXD2 (in, see TCU[2D]), ETH_RXD3 (in, see TCU[2D]), ETH_TX_CLK (in, see TCU[2C]), ETH_TX_EN (out, see TCU[2C]), ETH_TXD0 (out, see TCU[2C]), ETH_TXD1 (out, see TCU[2C]), ETH_TXD2 (out, see TCU[2C]), ETH_TXD3 (out, see TCU[2C]), I2C1_SCL (out, see TCU[2A]), I2C1_SDA (bidir, see TCU[2A]), IC_PWM_SPARE (bidir, see TCU[2B]), IMU_INT1 (bidir, see TCU[2A]), IMU_INT2 (bidir, see TCU[2A]), IMU_INT3 (bidir, see TCU[2A]), IMU_INT4 (bidir, see TCU[2A]), OSC_IN (out, see TCU[3B], Oscillator[2B]), OSC_OUT (out, see TCU[3B], Oscillator[2B]), RESET (in, see TCU[3B], Programming[2B]), SDIO_CK (out, see TCU[3B], MicroSD[2B]), SDIO_CMD (out, see TCU[3B], MicroSD[2B]), SDIO_D0 (out, see TCU[3B], MicroSD[3B]), SDIO_D1 (out, see TCU[3C], MicroSD[3B]), SDIO_D2 (out, see TCU[3C], MicroSD[2B]), SDIO_D3 (out, see TCU[3C], MicroSD[2B]), SWCLK (out, see TCU[3B], Programming[2B]), SWDIO (bidir, see TCU[3B], Programming[2B]), UART_DEBUG2MCU (in, see TCU[3B]), UART_MCU2DEBUG (out, see TCU[3B]), USB_FS_DETECT (in, see TCU[3C]), USB_FS_DN (bidir, see TCU[3C]), USB_FS_DP (bidir, see TCU[3C])

### Nets
3V3: C6.1 C7.1 C8.1 C9.1 C10.1 C11.1 C12.2 C13.2 C14.2 C15.2 C16.2 C17.2 C18.2 R2.2 R3.2 U2.6(VBAT) U2.11(VDD_1) U2.19(VDD_2) U2.21(VREF+) U2.22(VDDA) U2.28(VDD_3) U2.50(VDD_4) U2.75(VDD_5) U2.100(VDD_6)  [also labelled MCU_PWR, MCU_VDDA, MCU_VREF]  [project net AVDD33]
GND: C4.2 C5.2 C6.2 C7.2 C8.2 C9.2 C10.2 C11.2 C12.1 C13.1 C14.1 C15.1 C16.1 C17.1 C18.1 U2.10(VSS_1) U2.20(VSSA) U2.27(VSS_2) U2.74(VSS_3) U2.94(BOOT0) U2.99(VSS_4)
MII_MDC: U2.16(PC1) ; port ETH_MDC
MII_MDIO: U2.25(PA2) ; port ETH_MDIO
RESET: U2.14(NRST) ; port RESET
SD_CK: U2.80(PC12) ; port SDIO_CK
SD_CMD: U2.83(PD2) ; port SDIO_CMD
SD_D0: U2.65(PC8) ; port SDIO_D0
SD_D1: U2.66(PC9) ; port SDIO_D1
SD_D2: U2.78(PC10) ; port SDIO_D2
SD_D3: U2.79(PC11) ; port SDIO_D3
SWCLK: U2.76(PA14) ; port SWCLK
SWDIO: U2.72(PA13) ; port SWDIO
UART_DGB2MCU: U2.69(PA10) ; port UART_DEBUG2MCU
UART_MCU2DGB: U2.68(PA9) ; port UART_MCU2DEBUG
USB_BOARD_N: U2.70(PA11) ; port USB_FS_DN
USB_BOARD_P: U2.71(PA12) ; port USB_FS_DP
VCAP1: C4.1 U2.49(VCAP_1)
VCAP2: C5.1 U2.73(VCAP_2)
NetC20_2: U2.12(PH0-OSC_IN) ; port OSC_IN
NetIC1_1: U2.97(PE0) ; port IMU_INT2
NetIC1_12: U2.98(PE1) ; port IMU_INT3
NetIC1_13: U2.2(PE3) ; port IMU_INT4
NetIC1_16: U2.93(PB7) ; port IMU_INT1
NetIC2_7: U2.56(PD9) ; port DP83848CVV_INT
NetIC2_29: U2.8(PC14) ; port DP83848CVV_nRESET
NetIC2_41: U2.30(PA5) ; port DP83848CVV_RX_ER
NetJ3_3: R3.1 U2.95(PB8) ; port I2C1_SCL
NetJ3_5: U2.4(PE5) ; port IC_PWM_SPARE
NetJ3_8: R2.1 U2.96(PB9) ; port I2C1_SDA
NetR5_1: U2.13(PH1-OSC_OUT) ; port OSC_OUT
NetR14_1: U2.51(PB12) ; port ETH_TXD0
NetR15_1: U2.33(PC4) ; port ETH_RXD0
NetR16_1: U2.52(PB13) ; port ETH_TXD1
NetR17_1: U2.34(PC5) ; port ETH_RXD1
NetR18_1: U2.17(PC2) ; port ETH_TXD2
NetR19_1: U2.35(PB0) ; port ETH_RXD2
NetR20_1: U2.1(PE2) ; port ETH_TXD3
NetR21_1: U2.36(PB1) ; port ETH_RXD3
NetR22_1: U2.18(PC3) ; port ETH_TX_CLK
NetR23_1: U2.48(PB11) ; port ETH_TX_EN
NetR26_1: U2.23(PA0) ; port ETH_CRS
NetR27_1: U2.32(PA7) ; port ETH_RX_DV
NetR28_1: U2.24(PA1) ; port ETH_RX_CLK
NetR29_1: U2.26(PA3) ; port ETH_COL
NetR48_2: U2.67(PA8) ; port USB_FS_DETECT
NetU2_81: U2.81(PD0) ; port CAN1_RX
NetU2_82: U2.82(PD1) ; port CAN1_TX
NetU2_91: U2.91(PB5) ; port CAN2_RX
NetU2_92: U2.92(PB6) ; port CAN2_TX

Not connected (* = marked no-connect by the designer): U2 3(PE4) 5(PE6) 7(PC13) 9(PC15) 15(PC0) 29(PA4) 31(PA6) 37(PB2) 38(PE7) 39(PE8) 40(PE9) 41(PE10) 42(PE11) 43(PE12) 44(PE13) 45(PE14) 46(PE15) 47(PB10) 53(PB14) 54(PB15) 55(PD8) 57(PD10) 58(PD11) 59(PD12) 60(PD13) 61(PD14) 62(PD15) 63(PC6) 64(PC7) 77(PA15) 84(PD3) 85(PD4) 86(PD5) 87(PD6) 88(PD7) 89(PB3) 90(PB4)

### Notes on the sheet
- Set PA5 to open drain
- (near R2) I2C1 configured for 400k clock
- Set PD9 to open drain
- Set PC14 to open drain
- VDD_1
- VDD_2
- VDD_3
- VDD_4
- VDD_5
- VDD_6
- VBAT

### Library data of the parts
C4 C5 = CMP-2006-02259-2: CAP CER 2.2UF 16V X5R 0603; Dielectric Material: Ceramic; Tolerance: 10%; Dissipation Factor: 5%; Series: C; Voltage Rating (DC): 16V; REACH SVHC: No SVHC; RoHS Compliant: Yes; Number of Pins: 2; Max Operating Temperature: 85°C; Voltage Rating: 16V; Min Operating Temperature: -55°C; Termination: SMD/SMT; Dielectric: X5R; Packaging: Tape and Reel; Contact Plating: Tin; Case Code (Metric): 1608; Height: 0.8mm; Case/Package: 0603; Width: 0.8mm; Construction: Flat; Depth: 0.8mm; Thickness: 0.034inch; Radiation Hardening: No; Length: 1.6mm; Mount: Surface Mount; Case Code (Imperial): 0603; Voltage: 16V; Package Quantity: 1; Lead Free: Lead Free
C6 C8 C12-C18 = CMP-2006-03300-1: as C40 on sheet MicroSD; Part Number: C0603X104K5RACTU; Supplier 1: Digi-Key; Supplier Part Number 1: 399-7969-1-ND; Manufacturer Part Number: C0603X104K5RACTU; Stock 1: 2206541; Pricing 1: 1 = 0.21000, 10 = 0.14500, 100 = 0.07340, 500 = 0.05024, 1000 = 0.04444 (USD); RoHS: Yes; Mount: Surface Mount; Case/Package: 0603; Number of Pins: 2; Case Code (Metric): 1608; Min Operating Temperature: -55°C; Max Operating Temperature: 125°C; Packaging: Tape and Reel; Package Quantity: 1; Voltage Rating (DC): 50V; Termination: SMD/SMT; Voltage: 50V; Features: Soft Termination; Length: 1.6mm; Height: 0.8mm; Width: 0.8mm; Depth: 0.8mm; Thickness: 0.034inch; Radiation Hardening: No; REACH SVHC: No SVHC; ComponentLink1URL: https://datasheet.ciiva.com/7823/1776088-7823908.pdf?src-supplier=Element14; ComponentLink1Description: https://datasheet.ciiva.com/7823/1776088-7823908.pdf?src-supplier=Element14; ComponentLink2URL: https://datasheet.ciiva.com/26948/getdatasheetpartid-385607-26948458.pdf?src-supplier=Verical; ComponentLink2Description: https://datasheet.ciiva.com/26948/getdatasheetpartid-385607-26948458.pdf?src-supplier=Verical; ComponentLink3URL: https://datasheet.ciiva.com/7823/1776088-7823909.pdf?src-supplier=Element14; ComponentLink3Description: https://datasheet.ciiva.com/7823/1776088-7823909.pdf?src-supplier=Element14; ComponentLink4URL: https://datasheet.ciiva.com/6279/kem-c1013-x7r-ft-cap-smd-6279993.pdf?src-supplier=Digi-Key; ComponentLink4Description: https://datasheet.ciiva.com/6279/kem-c1013-x7r-ft-cap-smd-6279993.pdf?src-supplier=Digi-Key; ComponentLink5URL: https://datasheet.ciiva.com/28533/1918693-28533212.pdf?src-supplier=Element14; ComponentLink5Description: https://datasheet.ciiva.com/28533/1918693-28533212.pdf?src-supplier=Element14; ComponentLink6URL: https://datasheet.ciiva.com/6279/kem-c1013-x7r-ft-cap-smd-6279999.pdf?src-supplier=Digi-Key; ComponentLink6Description: https://datasheet.ciiva.com/6279/kem-c1013-x7r-ft-cap-smd-6279999.pdf?src-supplier=Digi-Key; ComponentLink7URL: https://datasheet.ciiva.com/6279/kem-c1013-x7r-ft-cap-smd-6279990.pdf?src-supplier=Digi-Key; ComponentLink7Description: https://datasheet.ciiva.com/6279/kem-c1013-x7r-ft-cap-smd-6279990.pdf?src-supplier=Digi-Key; ComponentLink8URL: https://datasheet.ciiva.com/14597/70096394-14597743.pdf?src-supplier=Allied+Electronics; ComponentLink8Description: https://datasheet.ciiva.com/14597/70096394-14597743.pdf?src-supplier=Allied+Electronics
C7 C9 C10 = CMP-13271-004127-1: Cap Ceramic 1uF 25V X5R ±10% Pad SMD 0603 +85°C T/R; Height: 0.8mm; Depth: 0.8mm; Package Quantity: 1; Mount: Surface Mount; Contact Plating: Tin; Voltage Rating: 25V; Dielectric: X5R; Packaging: Tape and Reel; Material: Ceramic; Case Code (Metric): 1608; Length: 1.6mm; Voltage: 25V; Min Operating Temperature: -55°C; Width: 0.031inch; Tolerance: 10%; Case/Package: 0603; Radiation Hardening: No; Case Code (Imperial): 0603; Thickness: 0.035inch; Lead Free: Lead Free; Max Operating Temperature: 85°C; Voltage Rating (DC): 25V
C11 = CMP-2000-05997-2: CAP CER 4.7UF 10V X5R 0402; Dielectric Material: Ceramic; Tolerance: 10%; Series: C; Package Quantity: 10000; Max Operating Temperature: 85°C; Case Code (Imperial): 0402; Lead Free: Lead Free; Voltage Rating (DC): 10V; Packaging: Cut Tape; Voltage Rating: 10V; Min Operating Temperature: -55°C; Dielectric: X5R; Thickness: 0.022inch; Width: 0.02inch; Case/Package: 0402; Case Code (Metric): 1005; Length: 0.039inch; RoHS Compliant: Yes; REACH SVHC: No SVHC; Mount: Surface Mount
R2 R3 = CMP-2003-02030-2: RES Thick Film, 2kΩ, 5%, 0.25W, 200ppm/°C, 1206; Resistance: 2kR; Max Power Dissipation: 250mW; Voltage Rating: 200V; Case Code (Imperial): 1206; Min Operating Temperature: -55°C; Number of Pins: 2; Tolerance: 5%; Contact Plating: Tin; Temperature Coefficient: 200ppm/°C; Features: Automotive AEC-Q200; Max Operating Temperature: 155°C; Military Standard: Not; Package Quantity: 1; Radiation Hardening: No; Composition: Thick Film; Weight: 0.000353oz; Number of Terminations: 2; Width: 0.063inch; Length: 3.2mm; Depth: 1.6mm; Voltage Rating (DC): 200V; Power Rating: 250mW; Height: 0.024inch; Case/Package: 1206; Lead Free: Lead Free; Case Code (Metric): 3216; Packaging: Tape and Reel
U2 = STM32F417VGT6TR: RISC Microcontroller, 32-Bit, FLASH, CORTEX-M4 CPU, 168MHz, CMOS, PQFP100; Manufacturer: STMicroelectronics; Package Body Material: Plastic; Max Frequency: 26MHz; Number of I/O Lines: 82; Package Equivalence Code: QFP100,.63SQ,20; Power Supplies: 2/3.3V; Speed: 168RPM; Max Supply Current: 109mA; Max Supply Voltage: 3.6V; Min Supply Voltage: 1.8V; Supply Voltage-Nom: 3.3V; Qualification Status: Not Qualified; Supplier 1: Mouser; Manufacturer Part Number: STM32F417VGT6TR; RoHS: Yes; Category: Microcontrollers; Stock 1: 905; Pricing 1: 1=15.23, 10=14, 25=13.42, 50=13.42, 100=11.9, 1000=11.87, 10000=11.87 (USD); Package Code: LFQFP; Number of Pins: 100; Package Shape: Square; Min Operating Temperature: -40°C; Max Operating Temperature: 85°C; JESD-30 Code: S-PQFP-G100; Package Style: FLATPACK, LOW PROFILE, FINE PITCHMeter; Surface Mount: Yes; Technology: CMOS; Terminal Form: Gull Wing; Terminal Position: QUAD; Length: 14mm; Width: 14mm; Height - Seated (Max): 1.6mm; Terminal Pitch: 0.5mm; Reach SVHC Compliant: Yes; RoHS Compliant: Yes; Temperature Grade: INDUSTRIAL; ComponentLink1URL: https://datasheet.ciiva.com:443/pdfs/VipMasterIC/IC/SGST/SGST-S-A0002807758/SGST-S-A0002807758-1.pdf?src-supplier=IHS+Markit; ComponentLink1Description: https://datasheet.ciiva.com:443/pdfs/VipMasterIC/IC/SGST/SGST-S-A0002807758/SGST-S-A0002807758-1.pdf?src-supplier=IHS+Markit; ComponentLink2URL: https://datasheet.ciiva.com/29987/dm00035129-29987056.pdf?src-supplier=Avnet; ComponentLink2Description: https://datasheet.ciiva.com/29987/dm00035129-29987056.pdf?src-supplier=Avnet; Supplier Part Number 1: 511-STM32F417VGT6TR

## Sheet MainConnector.SchDoc
size A; SheetNumber: 8; SheetTotal: 10
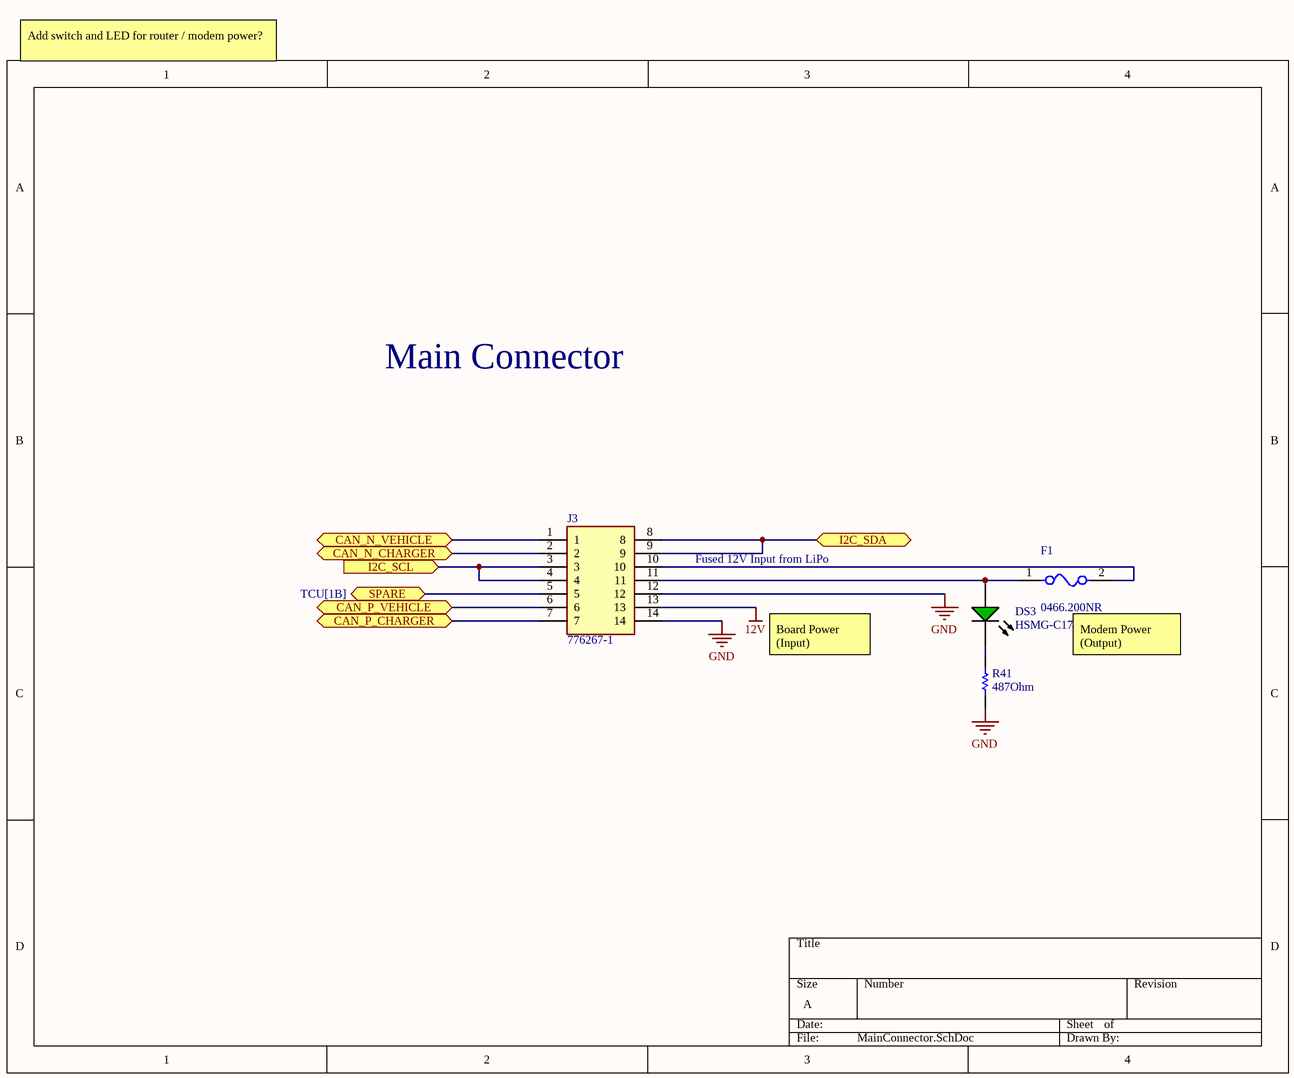
[diagram p6: MainConnector.SchDoc]

### Parts
DS3  HSMG-C170  [AVAG-HSMX-C170_V]
F1  0466.200NR  [FP-0466-MFG]
J3  776267-1  [776267-1]
R41  value 487Ohm  [RESC2013X60X35NL10T20]  (hidden comment: RC0805FR-07487RL)

### Ports
CAN_N_CHARGER (bidir, see TCU[1B]), CAN_N_VEHICLE (bidir, see TCU[1B]), CAN_P_CHARGER (bidir, see TCU[1B]), CAN_P_VEHICLE (bidir, see TCU[1B]), I2C_SCL (in, see TCU[1A], IMU[3B]), I2C_SDA (bidir, see TCU[1B], IMU[3B]), SPARE (bidir, see TCU[1B])

### Nets
12V: J3.13
GND: J3.12 J3.14 R41.1
CAN_CONN_H: J3.6 ; port CAN_P_VEHICLE
CAN_CONN_H: J3.7 ; port CAN_P_CHARGER  [a separate net that carries the same name]
CAN_CONN_L: J3.1 ; port CAN_N_VEHICLE
CAN_CONN_L: J3.2 ; port CAN_N_CHARGER  [a separate net that carries the same name]
NetDS3_1: DS3.1(A) F1.1 J3.11
NetDS3_2: DS3.2(K) R41.2
NetF1_2: F1.2 J3.10
NetJ3_3: J3.3 J3.4 ; port I2C_SCL
NetJ3_5: J3.5 ; port SPARE
NetJ3_8: J3.8 J3.9 ; port I2C_SDA

### Notes on the sheet
- Add switch and LED for router / modem power?
- Main Connector
- Fused 12V Input from LiPo
- Board Power (Input)
- (near F1) Modem Power (Output)

### Library data of the parts
DS3 = CMP-2000-05062-1: Chip LED, Green, 2.2 V, -40 to 85 degC, 2-Pin SMD, Pb-Free, Tape and Reel; Manufacturer: Avago; No. of Pins: 2; Peak Wavelength: 570nm; SVHC: NoSVHC(16-Jun-2014); Dominant Wavelength: 572nm; Forward Current If: 20mA; Viewing Angle: 170deg; Lens Shape: Rectangular; PIV Max: 5V; External Width: 1.25mm; LED Type: Standard; External Depth: 0.8mm; Opto Mounting Orientation: Top; Luminous Intensity: 15mcd; Luminous Intensity Min: 4mcd; Forward Voltage VF Max: 2.6V; External Length / Height: 2mm; Bulb Size: 1.25mmx1.4mm; Light Area Height: 1mm; Voltage Vf Typ: 2.2V; Operating Temperature Max: 85degC; Datasheet Version: Oct-08; MSL: MSL2A-4weeks; Peak Forward Current: 20mA; Package Description: 2-Pin Surface Mount Device, Body 2 x 1.25 mm, Height 0.8 mm; Datasheet URL: https://datasheet.ciiva.com/29280/180495-da-01-en-chip-led-hsmg-c170-gelb-gruen-29280971.pdf; Storage Temperature Min: -40degC; LED Colour: Green; Wavelength Typ: 570nm; Mounting Type: SMD; Forward Current If Max: 20mA; Dominant Wavelength Typ: 572nm; LED Mounting: SMD; Operating Temperature Range: -30degCto+85degC; Operating Temperature Min: -30degC; Manufacturer URL: http://www.avagotech.com/; Packaging: CutTape; Luminous Intensity Typ: 15mcd; Package Reference: HSMX-C170; Storage Temperature Max: 85degC; Opto Case Style: SMD; Forward Voltage: 2.2V
F1 = CMP-08605-000081-1: FUSE BOARD MNT 200MA 125VAC/VDC; Body Material: Thermoplastic; Voltage Rating: 125V; Fuse Type: Board Mount (Cartridge Style Excluded); Resistance: 1.15R; Approvals: UL; DC Cold Resistance: 1.16R; Case Code (Metric): 3216; Depth: 1.52mm; Case/Package: 1206; Lead Free: Lead Free; Length: 3.18mm; Max Operating Temperature: 90°C; Case Code (Imperial): 1206; Terminal Material: Copper; Radiation Hardening: No; Working Voltage: 125V; Packaging: Tape and Reel; Width: 0.06inch; Housing Material: Ceramic; Voltage Rating (AC): 125V; Current Rating: 200mA; Fuse Current: 200mA; Package Quantity: 5000; Height: 0.023inch; Termination: SMD/SMT; Voltage Rating (DC): 125V; Mount: Surface Mount; Min Operating Temperature: -55°C; Number of Pins: 2
J3 = 776267-1: Connector; Manufacturer_Name: TE Connectivity; Datasheet Link: http://www.te.com/commerce/DocumentDelivery/DDEController?Action=srchrtrv&DocNm=776267&DocType=Customer+Drawing&DocLang=English; Manufacturer_Part_Number: 776267-1; Mouser Part Number: 571-776267-1; Mouser Price/Stock: https://www.mouser.co.uk/ProductDetail/TE-Connectivity/776267-1?qs=tLAa1RwIH6fSgzpmDTOXQA%3D%3D; Arrow Part Number: 776267-1; Arrow Price/Stock: https://www.arrow.com/en/products/776267-1/te-connectivity?region=europe
R41 = CMP-2001-01162-1: Manufacturer: Yageo; Part Number: RC0805FR-07487RL